# EAGLE design stereo-jack (EAGLE 9.0.1)
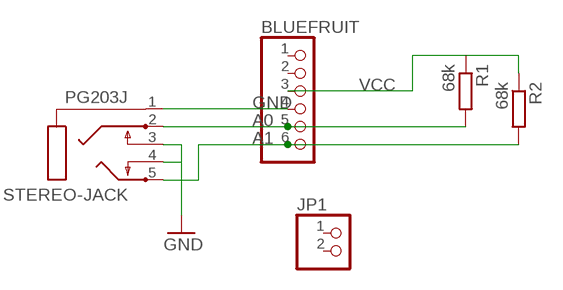
[diagram p0: schematic, sheet 1]

## Parts
BLUEFRUIT  PINHD-1X6  [1X06]
JP1  PINHD-1X2  [1X02]
R1  68k  R-EU_0207/7  [0207/7]
R2  68k  R-EU_0207/7  [0207/7]
STEREO-JACK  PG203J  [PG203J]

## Nets
A0: BLUEFRUIT.5 R1.2 STEREO-JACK.2
A1: BLUEFRUIT.6 R2.2 STEREO-JACK.5
GND: BLUEFRUIT.4 STEREO-JACK.1 STEREO-JACK.3 STEREO-JACK.4
VCC: BLUEFRUIT.3 R1.1 R2.1
Unconnected: BLUEFRUIT.1 BLUEFRUIT.2 JP1.1 JP1.2

## Library data of the parts
BLUEFRUIT = pinhead:PINHD-1X6: PIN HEADER
JP1 = pinhead:PINHD-1X2: PIN HEADER
R1 R2 = resistor:R-EU_: RESISTOR, European symbol
STEREO-JACK = con-hirschmann:PG203J: MIC/HEADPHONE JACK KS-S stereo microphone/headphone jack PG203JN (Schukat); OC_FARNELL: unknown; OC_NEWARK: unknown

## Board
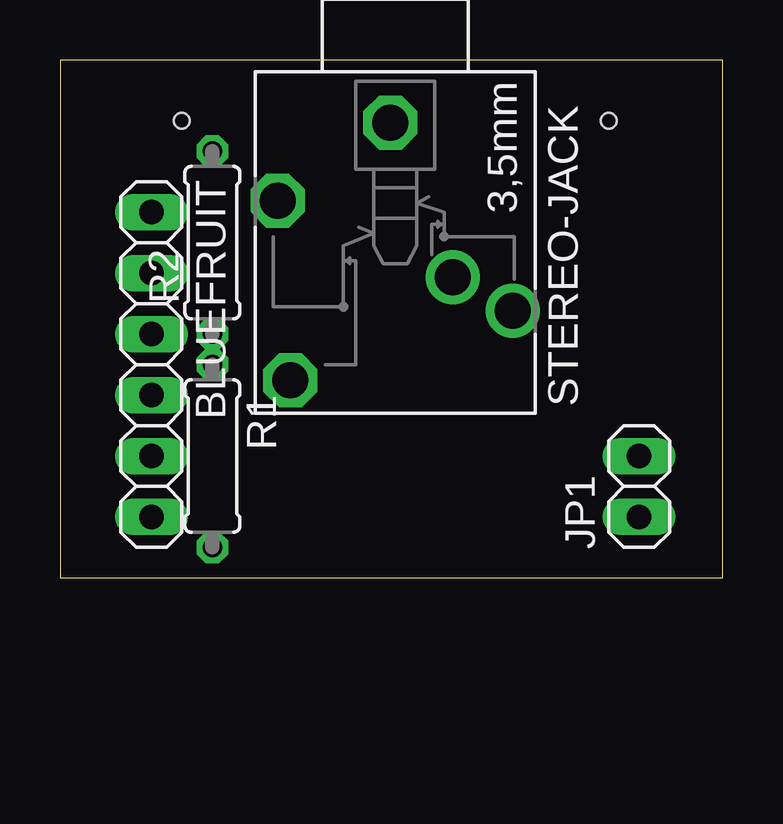
[diagram p1: board, top side]
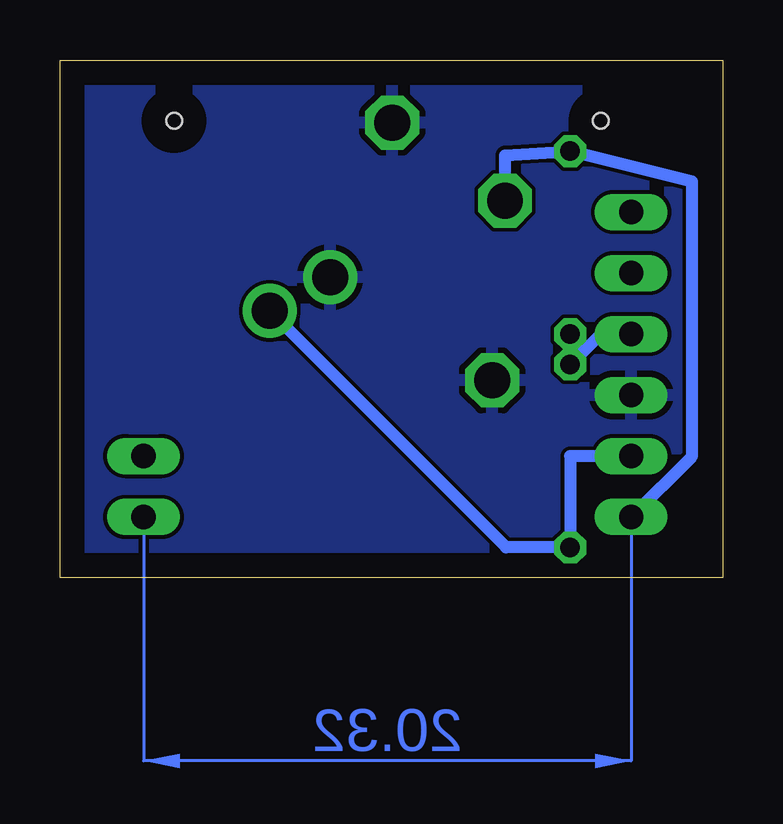
[diagram p2: board, bottom side, seen from below]

Size 27.61 x 21.58 mm. Coordinates in mm from the lower left corner, seen from the top.
Outline: 0,0 27.61,0 27.61,21.58 0,21.58 0,0
Copper layers (1*16): Top 0.035mm / dielectric 1.5mm / Bottom 0.035mm
Design rules "default": minimum track width 6mil, minimum drill 0.35mm, track to track 6mil, track to pad 6mil, pad to pad 6mil, via to via 6mil, smd to smd 6mil, copper to edge 40mil, drill to drill 6mil, minimum pad ring 10mil, minimum via ring 8mil, stop-mask expansion 4mil, vias tented up to drill 0mil, thermal gap 10mil
Holes 0.65 mm at 5.08,19.05 22.86,19.05

### Footprints (pad centres in the part's own frame; a part is rotated, then mirrored left to right if it is on the bottom)
1X06 = drill 1.016 long: 1 -6.35,0; 2 -3.81,0; 3 -1.27,0; 4 1.27,0; 5 3.81,0; 6 6.35,0
1X02 = drill 1.016 long: 1 -1.27,0; 2 1.27,0
0207/7 = drill 0.813 octagon: 1 -3.81,0; 2 3.81,0
PG203J = drill 1.499 octagon: 1 -5.004,-0.203; 4 5.74,-4.369; 5 -1.753,-4.902 | drill 1.499: 2 2.845,4.902; 3 1.448,2.388

### Placement (x,y rotation side)
BLUEFRUIT  3.81,8.89 270 top
JP1  24.13,3.81 90 top
R1  6.35,5.08 270 top
R2  6.35,13.97 90 top
STEREO-JACK  13.97,13.97 270 top

### Tracks (layer width: path | path; a pad name or v marks a point on that pad's centre or on a via)
A0
  Bottom 0.508: STEREO-JACK.2 9.02,1.27 R1.2 6.35,5.08 BLUEFRUIT.5
A1
  Bottom 0.508: STEREO-JACK.5 9.07,17.6 R2.2 1.27,16.51 1.27,5.08 BLUEFRUIT.6
GND
  pour Bottom: 0,22.86 27.94,22.86 27.94,0 0,0
VCC
  Bottom 0.508: R2.1 R1.1 5.08,10.16 BLUEFRUIT.3
(copper drawn outside any net)
  shapes: Bottom area x1